# EAGLE design LB_i16-Pulse-v03(rev2) (EAGLE 6.6.0)
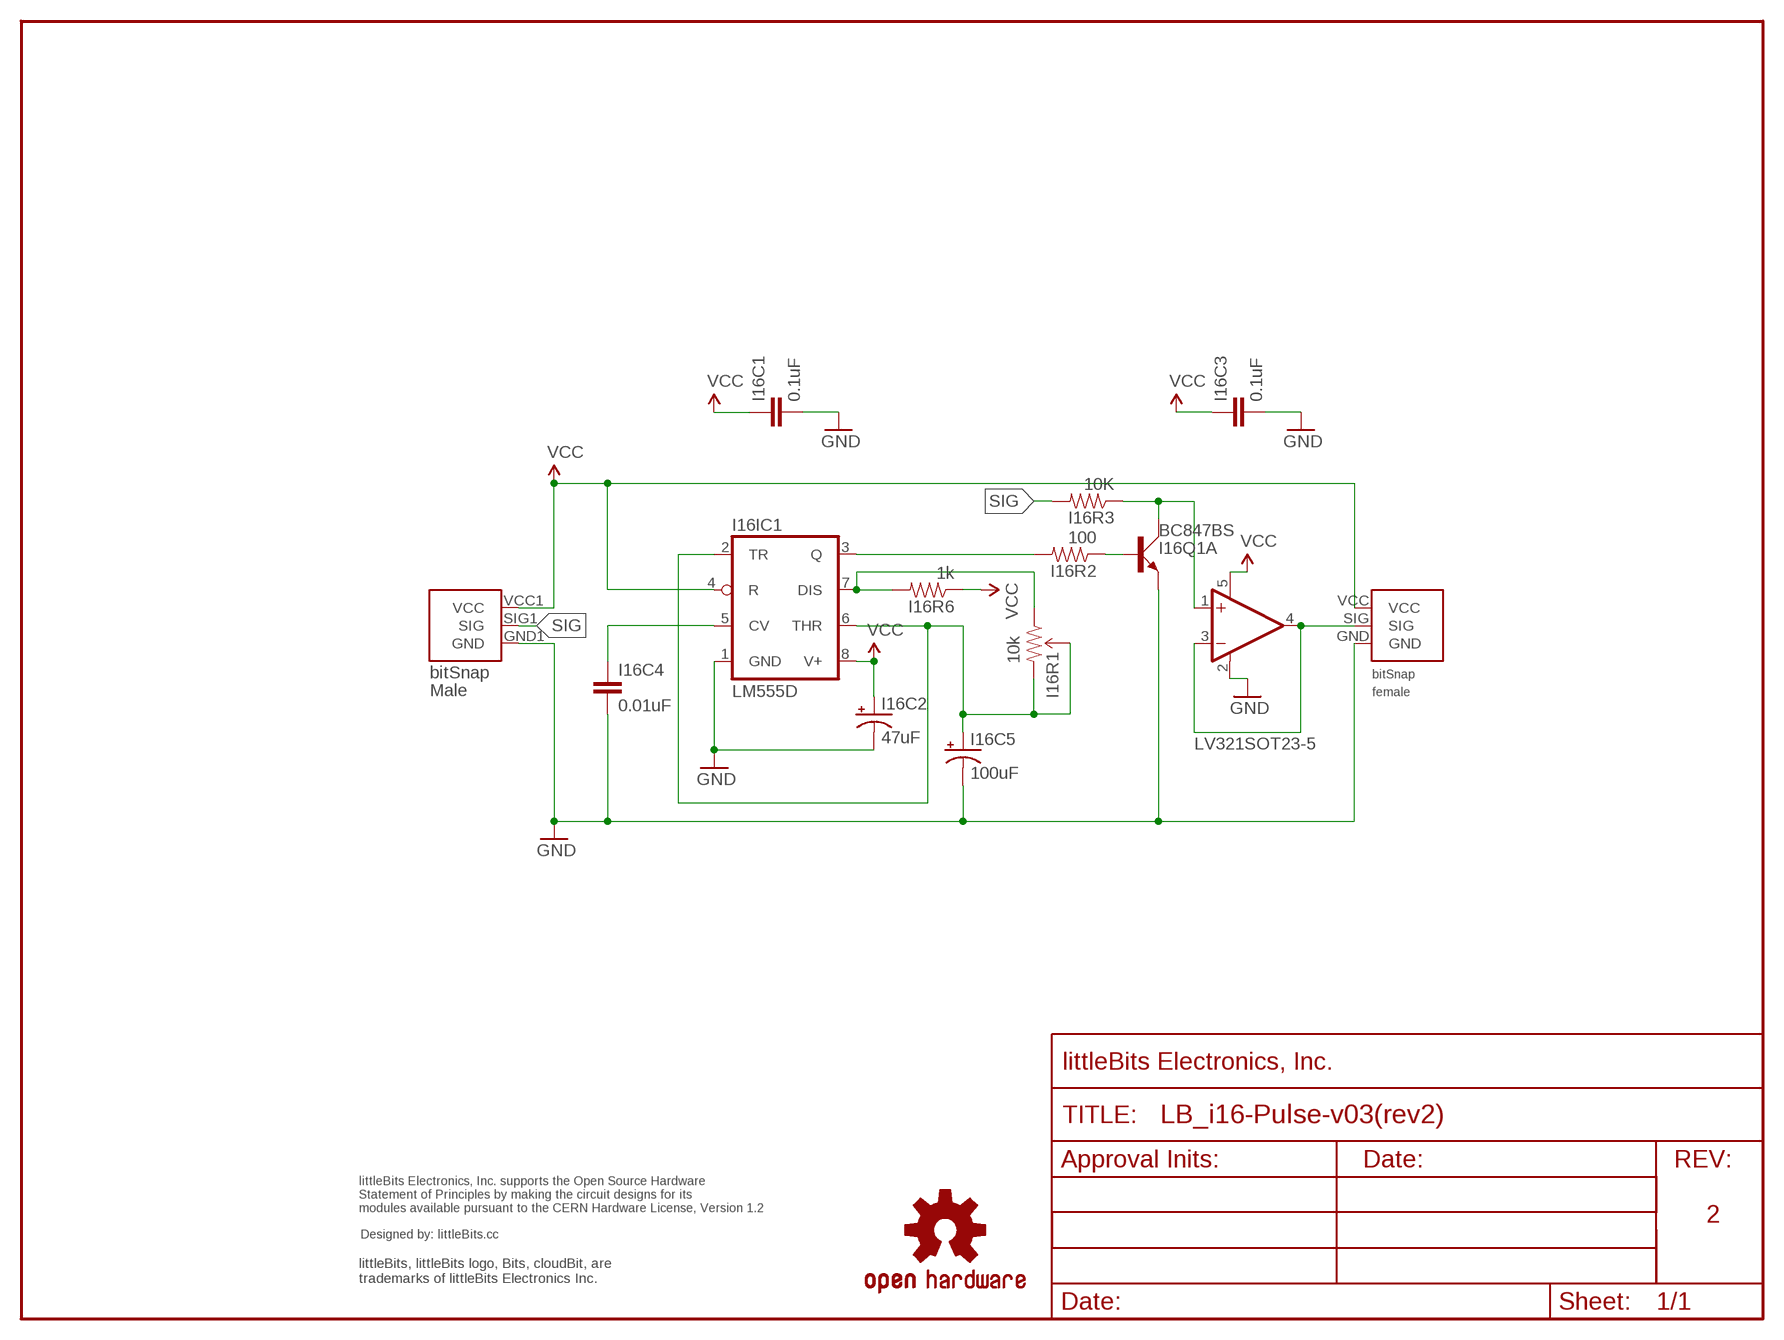
[diagram p0: schematic, sheet 1]

## Parts
I16BSF1  BITSNAP_V03_FEMALE  [BITSNAP_V03_FEMALE]
I16BSM1  BITSNAP_V03_MALE  [BITSNAP_V03_MALE]
I16C1  0.1uF  CAP0603-CAP  [0603-CAP]
I16C2  47uF  CAP_POL3528  [EIA3528]
I16C3  0.1uF  CAP0603-CAP  [0603-CAP]
I16C4  0.01uF  CAP0603-CAP  [0603-CAP]
I16C5  100uF  CAP_POL6032  [EIA6032]
I16IC1  LM555D  [SO08]
I16Q1  BC847BS  [SOT363_PHILIPS]
I16R1  10k  TRIMPOTSMD  [TRIMPOT-3MM]
I16R2  100  RESISTOR0603-RES  [0603-RES]
I16R3  10K  RESISTOR0603-RES  [0603-RES]
I16R6  1k  RESISTOR0603-RES  [0603-RES]
I16U3  LV321SOT23-5  [SOT23-5]
U$1  OSHWCREDIT  [OSHWCREDIT]
U$2  FRAME-LETTER-OHWOHW  [FABDWG01-OHW]
U$3  OSHW-LOGOL  [OSHW-LOGO-L]

## Nets
GND: I16BSF1.GND I16BSM1.GND1(GND) I16C1.2 I16C2.C(-) I16C3.2 I16C4.2 I16C5.P$2(-) I16IC1.1(GND) I16Q1.1(A:E) I16U3.2(V-)
N$1: I16Q1.6(A:C) I16R3.1 I16U3.1(+IN)
N$2: I16BSF1.SIG I16U3.3(-IN) I16U3.4(OUT)
N$5: I16IC1.3(Q) I16R2.2
N$6: I16Q1.2(A:B) I16R2.1
N$7: I16C4.1 I16IC1.5(CV)
N$8: I16IC1.7(DIS) I16R1.1(CCW) I16R6.2
N$9: I16C5.P$1(+) I16IC1.2(TR) I16IC1.6(THR) I16R1.2(WIPER) I16R1.3(CW)
SIG: I16BSM1.SIG1(SIG) I16R3.2
VCC: I16BSF1.VCC I16BSM1.VCC1(VCC) I16C1.1 I16C2.A(+) I16C3.1 I16IC1.4(R) I16IC1.8(V+) I16R6.1 I16U3.5(V+)
Unconnected: I16Q1.3(B:C) I16Q1.4(B:E) I16Q1.5(B:B)

## Notes on the sheet
- 2

## Library data of the parts
I16BSF1 = bitSnap:BITSNAP_V03_FEMALE
I16BSM1 = bitSnap:BITSNAP_V03_MALE
I16C1 I16C3 I16C4 = SparkFun:CAP: Capacitor Standard 0603 ceramic capacitor, and 0.1" leaded capacitor.
I16C2 = SparkFun:CAP_POL: Capacitor Polarized These are standard SMD and PTH capacitors. Normally 10uF, 47uF, and 100uF in electrolytic and tantalum varieties. Always verify the external diameter of the through hole cap, it varies with capacity, voltage, and manufacturer. The EIA devices should be standard.
I16C5 = SparkFun_NEW:CAP_POL: Capacitor Polarized These are standard SMD and PTH capacitors. Normally 10uF, 47uF, and 100uF in electrolytic and tantalum varieties. Always verify the external diameter of the through hole cap, it varies with capacity, voltage, and manufacturer. The EIA devices should be standard.
I16IC1 = linear:*555: TIMER
I16Q1 = transistor-small-signal:BC847BS: NPN general purpose double transistor Source: http://www.farnell.com/datasheets/2466.pdf
I16R1 = SparkFun:TRIMPOT
I16R2 I16R3 I16R6 = SparkFun:RESISTOR: Resistor Basic schematic elements and footprints for 0603, 1206, and PTH 1/10th watt (small) resistors.
I16U3 = LITTLEBITS:LV321
U$1 = LITTLEBITS:OSHWCREDIT
U$2 = LITTLEBITS:FRAME-LETTER-OHW
U$3 = SparkFun_NEW:OSHW-LOGO: Open Source Hardware Logo This logo indicates the piece of hardware it is found on incorporates a OSHW license and/or adheres to the definition of open source hardware found here: http://freedomdefined.org/OSHW

## Board
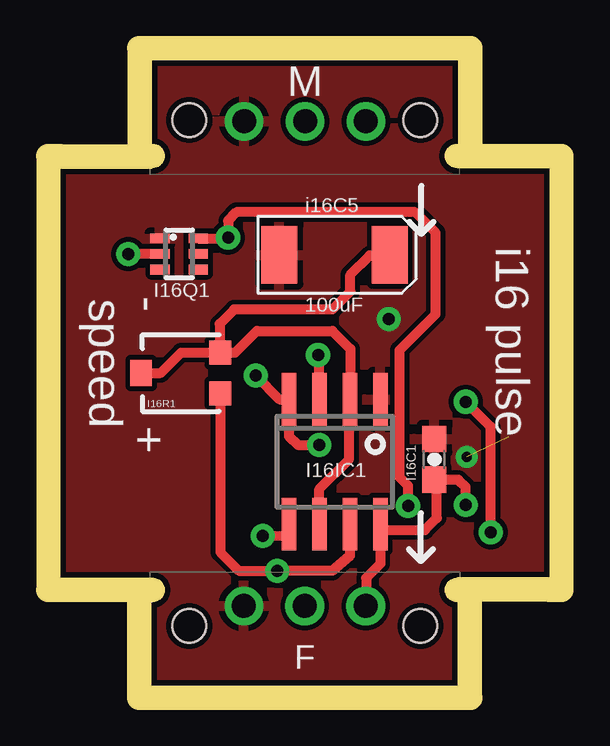
[diagram p1: board, top side]
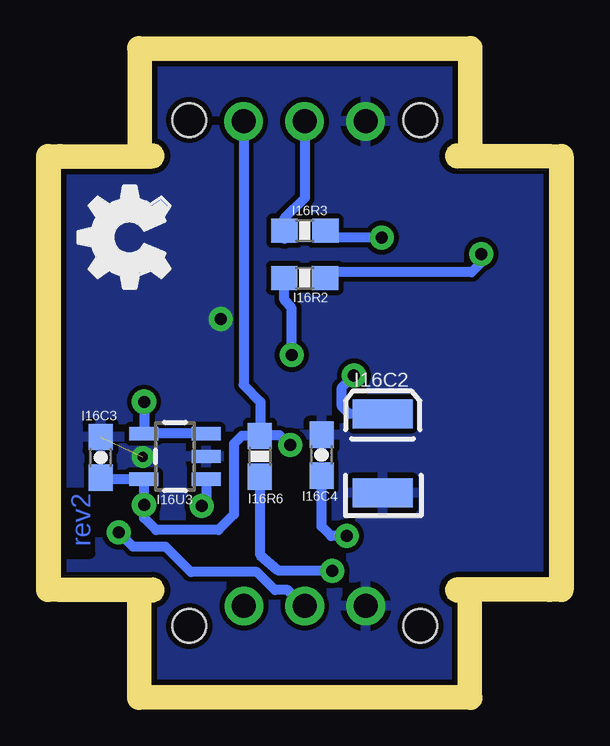
[diagram p2: board, bottom side, seen from below]

Size 20.4 x 26.1 mm. Coordinates in mm from the lower left corner, seen from the top.
Outline: 0,4.5 0,21.6
Outline: 20.4,21.6 20.4,4.5
Copper layers (1*16): Top 0.035mm / dielectric 1.5mm / Bottom 0.035mm
Design rules "default": minimum track width 8mil, minimum drill 20mil, track to track 8mil, track to pad 8mil, pad to pad 8mil, via to via 8mil, smd to smd 8mil, copper to edge 10mil, drill to drill 8mil, minimum pad ring 12mil, minimum via ring 10mil, stop-mask expansion 4mil, vias tented up to drill 25mil, thermal gap 10mil
Milling: 6 lines

### Footprints (pad centres in the part's own frame; a part is rotated, then mirrored left to right if it is on the bottom)
BITSNAP_V03_FEMALE = drill 1: GND 3.91,3.33; SIG 6.45,3.33; VCC 8.99,3.33 | hole 1.4: 1.63,2.5; 11.27,2.5
BITSNAP_V03_MALE = drill 1: GND1 8.98,2.56; SIG1 6.44,2.56; VCC1 3.9,2.56 | hole 1.4: 11.27,2.5; 1.63,2.5
0603-CAP = smd 1.1 x 1: 1 -0.85,0; 2 0.85,0
EIA3528 = smd 1.2 x 2.5: A 1.65,0; C -1.65,0
EIA6032 = smd 1.5 x 2.4: P$1 -2.3,0; P$2 2.3,0
SO08 = smd 0.6 x 2.2: 1 -1.905,-2.6; 2 -0.635,-2.6; 3 0.635,-2.6; 4 1.905,-2.6; 5 1.905,2.6; 6 0.635,2.6; 7 -0.635,2.6; 8 -1.905,2.6
SOT363_PHILIPS = smd 0.4 x 0.8: 1 -0.65,-0.8; 2 0,-0.8; 3 0.65,-0.8; 4 0.65,0.8; 5 0,0.8; 6 -0.65,0.8
TRIMPOT-3MM = smd 1 x 0.9: 1 -0.85,-1.65; 3 0.85,-1.65 | smd 1.1 x 0.9: 2 0,1.65
0603-RES = smd 1.1 x 1: 1 -0.85,0; 2 0.85,0
SOT23-5 = smd 0.55 x 1.2: 1 -0.95,-1.3; 2 0,-1.3; 3 0.95,-1.3; 4 0.95,1.3; 5 -0.95,1.3

### Placement (x,y rotation side)
I16BSF1  3.75,0 0 top
I16BSM1  16.65,26.1 180 top
I16C1  15.6,9.45 90 top
I16C2  6.95,9.69 90 bottom
I16C3  18.7,9.53 90 bottom
I16C4  9.5,9.62 90 bottom
I16C5  11.45,17.98 180 top
I16IC1  11.45,9.35 180 top
I16Q1  4.96,18.01 270 top
I16R1  5.03,13.05 90 top
I16R2  10.21,17.01 180 bottom
I16R3  10.2,18.98 180 bottom
I16R6  12.07,9.57 270 bottom
I16U3  15.61,9.57 90 bottom
U$1  -96.4,-61.95 0 top  (outside the outline)
U$2  0,0 0 top
U$3  -26.05,-63.51 0 top  (outside the outline)
U$20  [OSHW_FILLX150_NOTEXT]  15.82,15.75 0 top

### Tracks (layer width: path | path; a pad name or v marks a point on that pad's centre or on a via)
GND  (via drill 0.4, 0.5)  (1 unrouted)
  other vias: 16.95,9.55 13.7,15.3
  pour Top: 0.25,25.85 20.12,25.85 20.12,0.25 0.25,0.25
  pour Bottom: 0.25,25.85 20.12,25.85 20.12,0.25 0.25,0.25
N$1  (via drill 0.5)
  Top 0.406: I16Q1.6 6.96,18.66 v7,18.7 7,19.4 7.35,19.75 14.8,19.75 15.65,18.9 15.65,15.5 14.15,14 14.15,8.7 14.5,8.35 v14.5,7.5
  Bottom 0.406: v7,18.7 9.28,18.7 I16R3.1 | I16U3.1 14.31,7.71 v14.5,7.5
N$2  (via drill 0.5)
  Top 0.406: v17.95,6.4 17.95,10.8 v16.9,11.85
  Bottom 0.406: I16U3.3 I16U3.4 v16.9,11.85 | I16BSF1.SIG 10.9,4 11.45,4 12.2,4.75 14.95,4.75 16,5.8 17.35,5.8 v17.95,6.4
N$5  (via drill 0.5)
  Top 0.406: I16IC1.3 10.81,13.64 v10.75,13.8
  Bottom 0.406: v10.75,13.8 10.75,15.75 11.05,16.1 11.05,17.25 I16R2.2
N$6  (via drill 0.5)
  Top 0.406: I16Q1.2 2.86,18.01 v2.85,18
  Bottom 0.406: v2.85,18 2.85,17.65 3.25,17.25 9.35,17.25 I16R2.1
N$7  (via drill 0.5)
  Top 0.406: I16IC1.5 9.54,6.24 v8.45,6.25
  Bottom 0.406: v8.45,6.25 9.1,6.25 9.5,6.65 I16C4.1
N$8  (via drill 0.5)
  Top 0.406: I16IC1.7 12.08,5.43 11.35,4.8 v9.05,4.8 7.45,4.8 6.68,5.57 I16R1.1
  Bottom 0.406: v9.05,4.8 11.3,4.8 12.05,5.45 12.05,8.75 I16R6.2
N$9
  Top 0.406: I16R1.2 4.2,13.05 5.05,13.9 I16R1.3 | I16R1.3 7.3,13.9 8.2,14.8 11.35,14.8 12.1,14.05 12.1,11.97 I16IC1.2 12.05,11.87 12.05,9.45 10.81,8.21 I16IC1.6 | I16R1.3 6.65,13.93 6.65,15.1 7.25,15.7 11.35,15.7 12.1,16.45 12.1,17.15 12.9,17.95 14.22,17.95 I16C5.P$1
SIG
  Bottom 0.406: I16BSM1.SIG1 10.2,20.35 11.05,19.5 11.05,18.64 I16R3.2
VCC  (via drill 0.5)
  Top 0.406: I16BSF1.VCC 12.75,4.5 13.35,5.1 I16IC1.8 13.35,6.55 13.4,6.5 15.2,6.5 15.7,7 15.7,8.6 I16C1.1 16.6,8.6 16.9,8.3 v16.9,7.55 | v8.15,12.95 9.14,11.95 I16IC1.4 9.54,10.41 9.9,10.05 v10.8,10.05
  Bottom 0.406: I16C3.1 18.74,8.62 I16U3.5 16.91,7.76 v16.9,7.55 16.9,7 16.4,6.5 13.8,6.5 13.15,7.15 13.15,10.1 12.82,10.43 I16R6.1 | I16C2.A 8.34,11.34 8.65,11.65 8.65,12.45 v8.15,12.95 | v10.8,10.05 10.85,10.05 11.25,10.45 12.05,10.45 I16R6.1 | I16BSM1.VCC1 12.75,12.55 12.05,11.85 12.05,10.5 I16R6.1

### Text on the board
Bottom: rev2
tPlace: i16 pulse | speed | - | +
tNames: i16C5 | 100uF
Milling: 1mm DIA. ROUTER PATH
dxf: 2 | i16 PULSE GENERATOR BIT PCB | LB-BIT-i16-PULSE-v03-GERBER-rev2 (8-31-2012)